# EAGLE design kgopalak_SMD (EAGLE 8.3.2)
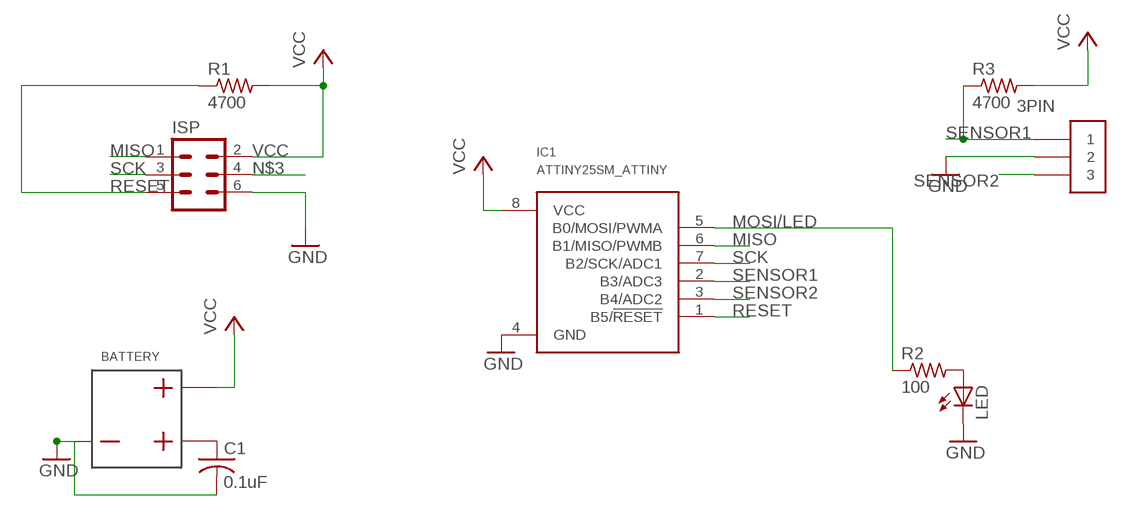
[diagram p0: schematic, sheet 1]

## Parts
3PIN  3PINCONSM_3PIN  [SM3PIN]
BATTERY  BATTERYSM_BA2032  [BA2032SM]
C1  0.1uF  CAPACITORSM_CAP  [C0402]
IC1  ATTINY25SM_ATTINY  [8S1]
ISP  6PINCON_ISPSM_6PIN  [SM6PIN]
LED  LEDSMLED  [CHIPLED_0603]
R1  4700  RESISTORSMRESISTOR  [R0402]
R2  100  RESISTORSMRESISTOR  [R0402]
R3  4700  RESISTORSMRESISTOR  [R0402]

## Nets
GND: 3PIN.2 BATTERY.1 C1.2 IC1.4(GND) ISP.6 LED.C
MISO: IC1.6(B1/MISO/PWMB) ISP.1
MOSI/LED: IC1.5(B0/MOSI/PWMA) R2.1
N$1: LED.A R2.2
N$3: ISP.4
N$14: BATTERY.3 C1.1
RESET: IC1.1(B5/!RESET) ISP.5 R1.1
SCK: IC1.7(B2/SCK/ADC1) ISP.3
SENSOR1: 3PIN.1 IC1.2(B3/ADC3) R3.1
SENSOR2: 3PIN.3 IC1.3(B4/ADC2)
VCC: BATTERY.2 IC1.8(VCC) ISP.2 R1.2 R3.2

## Library data of the parts
3PIN = TinyGadget(1):3PINCON
BATTERY = TinyGadget(1):BATTERY
C1 = TinyGadget(1):CAPACITOR
IC1 = TinyGadget(1):ATTINY25
ISP = TinyGadget(1):6PINCON_ISP
LED = TinyGadget(1):LED
R1-R3 = TinyGadget(1):RESISTOR

## Board
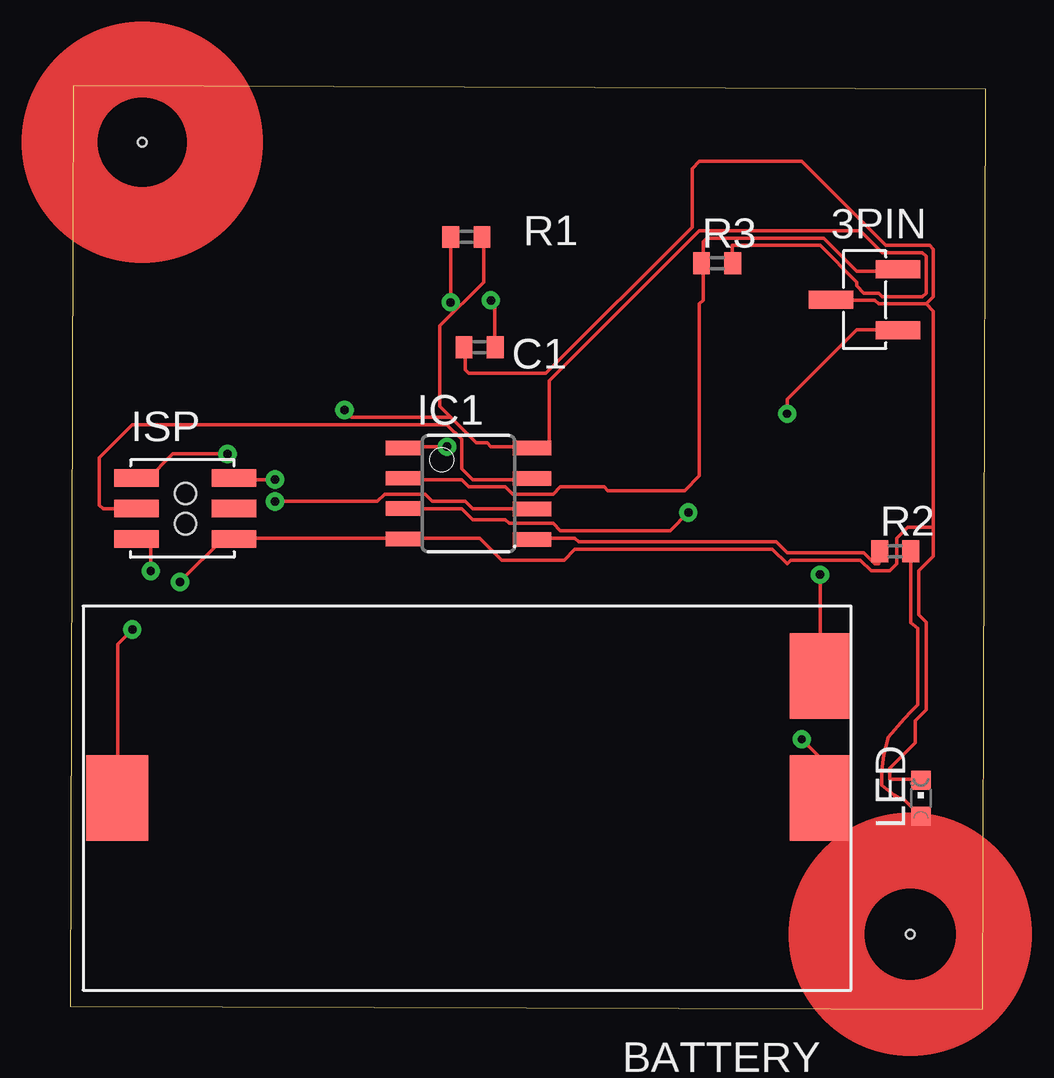
[diagram p1: board, top side]
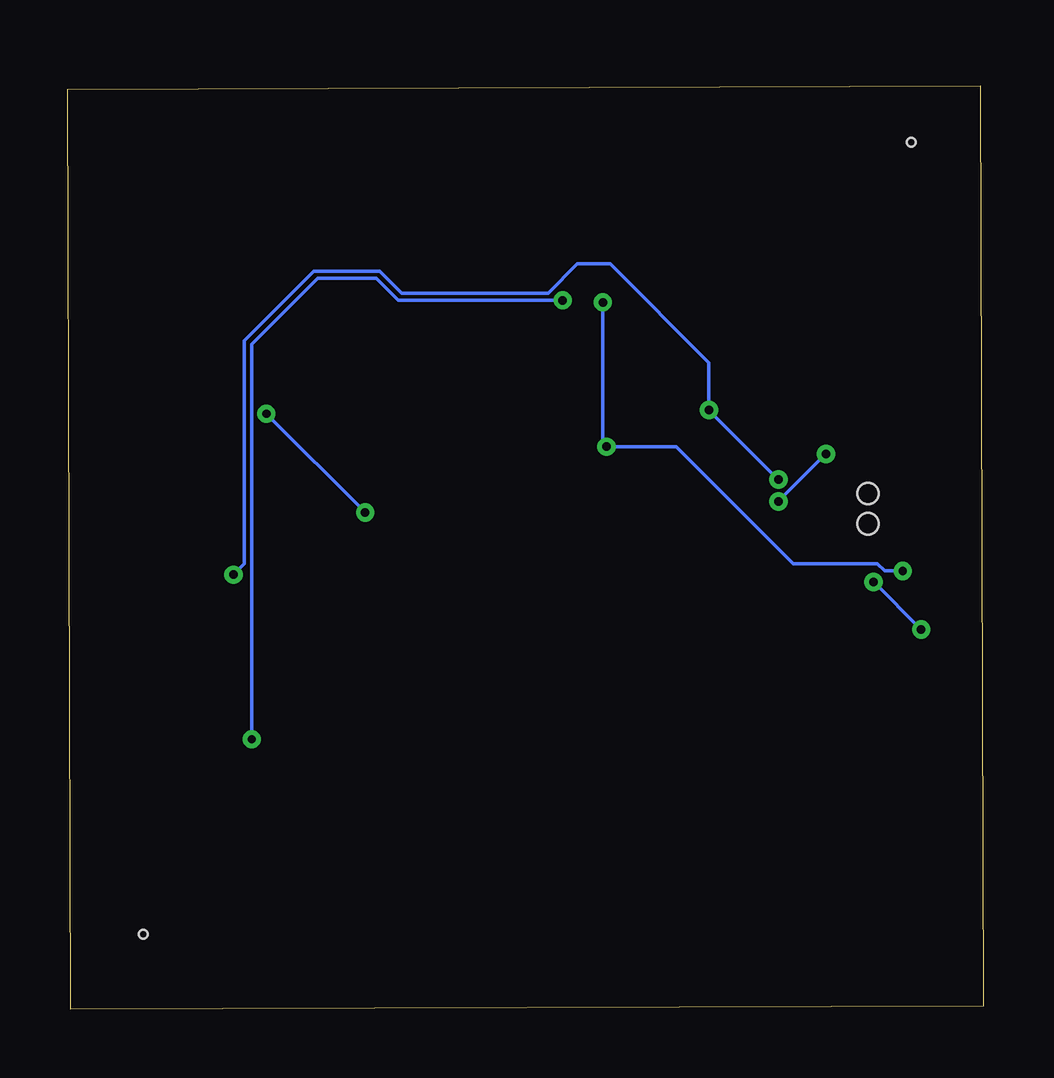
[diagram p2: board, bottom side, seen from below]

Size 38.15 x 38.47 mm. Coordinates in mm from the lower left corner, seen from the top.
Outline: 0,0.13 38.02,0 38.15,38.34 0.13,38.47 0,0.13
Copper layers (1*16): Top 0.035mm / dielectric 1.5mm / Bottom 0.035mm
Design rules "default": minimum track width 6mil, minimum drill 0.35mm, track to track 6mil, track to pad 6mil, pad to pad 6mil, via to via 6mil, smd to smd 6mil, copper to edge 40mil, drill to drill 6mil, minimum pad ring 10mil, minimum via ring 8mil, stop-mask expansion 4mil, vias tented up to drill 0mil, thermal gap 10mil
Holes 0.35 mm at 3,36.13 35,3.13

### Footprints (pad centres in the part's own frame; a part is rotated, then mirrored left to right if it is on the bottom)
SM3PIN = smd 0.737 x 1.854: 1 0,0; 2 1.27,-2.794; 3 2.54,0
BA2032SM = smd 2.591 x 3.556: 1 29.312,0; 2 0,-5.08; 3 0,0
C0402 = smd 0.7 x 0.9: 1 -0.65,0; 2 0.65,0
8S1 = smd 0.6 x 1.6: 1 -1.905,-2.654; 2 -0.645,-2.654; 3 0.625,-2.654; 4 1.895,-2.654; 5 1.905,2.654; 6 0.635,2.654; 7 -0.635,2.654; 8 -1.905,2.654
SM6PIN = smd 0.737 x 1.854: 1 0,-1.27; 2 0,2.794; 3 1.27,-1.27; 4 1.27,2.794; 5 2.54,-1.27; 6 2.54,2.794 | hole 0.889: 0.635,0.762; 1.905,0.762
CHIPLED_0603 = smd 0.8 x 0.8: A 0,-0.75; C 0,0.75
R0402 = smd 0.7 x 0.9: 1 -0.65,0; 2 0.65,0

### Placement (x,y rotation side)
3PIN  34.5,30.83 270 top
BATTERY  31.27,8.8 180 top
C1  17.06,27.58 180 top
IC1  16.59,21.48 270 top
ISP  4.04,22.13 270 top
LED  35.45,8.79 0 top
R1  16.51,32.19 0 top
R2  34.38,19.08 0 top
R3  26.96,31.08 0 top

### Tracks (layer width: path | path; a pad name or v marks a point on that pad's centre or on a via)
GND  (via drill 0.35)
  Top 0.152: v2.59,15.82 1.98,15.21 1.98,8.81 BATTERY.1 | v4.57,17.8 6.4,19.63 6.71,19.63 ISP.6 6.86,19.63 13.87,19.63 IC1.4 14.02,19.63 17.07,19.63 17.98,18.72 20.57,18.72 21.03,19.18 29.26,19.18 29.87,18.57 30.02,18.72 32.92,18.72 33.38,18.26 34.14,18.26 34.44,18.57 34.44,19.63 34.9,20.09 35.97,20.09 | 35.97,20.09 35.97,29.08 35.66,29.39 | 35.97,20.09 35.97,18.87 35.36,18.26 35.36,16.43 35.66,16.13 35.66,12.47 35.2,12.01 35.2,11.1 34.14,10.03 34.14,9.58 35.36,9.58 LED.C | 35.66,29.39 33.68,29.39 33.53,29.54 31.85,29.54 3PIN.2 | 35.66,29.39 35.97,29.69 35.97,31.67 35.81,31.83 33.98,31.83 30.48,35.33 26.21,35.33 25.91,35.03 25.91,32.59 19.81,26.49 16.61,26.49 16.46,26.64 16.46,27.56 C1.2
  Bottom 0.152: v4.57,17.8 v2.59,15.82
MISO  (via drill 0.35)
  Top 0.152: v8.53,21.16 12.8,21.16 13.11,21.46 14.78,21.46 15.09,21.16 16.46,21.16 16.76,20.85 19.2,20.85 IC1.6 | v6.55,23.14 4.27,23.14 3.2,22.07 2.9,22.07 ISP.1
  Bottom 0.152: v6.55,23.14 v8.53,21.16
MOSI/LED
  Top 0.152: R2.1 33.68,19.02 33.68,18.57 33.53,18.57 33.07,19.02 29.87,19.02 29.41,19.48 21.18,19.48 21.03,19.63 19.36,19.63 IC1.5
N$1
  Top 0.152: R2.2 35.03,16.11 35.32,15.88 35.32,13.88 35.32,12.7 35.05,12.43 34.75,12.1 34.08,11.34 33.99,11 33.89,10.58 33.81,9.95 33.81,9.54 33.81,9.33 34.33,8.93 34.55,8.79 34.7,8.79 LED.A
N$14  (via drill 0.35)
  Top 0.152: v17.53,29.54 17.68,29.39 17.68,27.71 C1.1 | v30.48,11.25 31.24,10.49 31.24,8.81 BATTERY.3
  Bottom 0.152: v17.53,29.54 24.38,29.54 25.3,30.45 27.74,30.45 30.48,27.71 v30.48,11.25
RESET  (via drill 0.35)
  Top 0.152: v15.85,29.45 15.85,32.13 R1.1 | v15.7,23.44 14.02,23.44 IC1.1 | v3.35,18.26 3.35,19.63 2.9,19.63 ISP.5
  Bottom 0.152: v15.85,29.45 15.85,23.6 v15.7,23.44 12.8,23.44 7.92,18.57 4.42,18.57 4.12,18.26 v3.35,18.26
SCK
  Top 0.152: IC1.7 19.2,22.07 16.76,22.07 16.31,22.53 16.31,23.75 15.7,24.36 2.59,24.36 1.22,22.99 1.22,21.01 1.37,20.85 2.74,20.85 ISP.3
SENSOR1
  Top 0.152: 3PIN.1 34.44,30.76 32.77,30.76 31.39,32.13 26.52,32.13 26.36,31.98 26.36,31.22 R3.1 26.36,31.06 26.36,29.54 26.21,29.39 26.21,22.22 25.6,21.61 22.4,21.61 22.25,21.77 20.42,21.77 20.12,21.46 18.44,21.46 18.14,21.77 16.61,21.77 16.31,22.07 14.02,22.07 IC1.2
SENSOR2  (via drill 0.35)
  Top 0.152: v25.76,20.7 24.99,19.94 20.42,19.94 20.12,20.24 18.29,20.24 18.14,20.4 16.76,20.4 16.31,20.85 14.02,20.85 IC1.3 | v29.87,24.82 29.87,25.42 32.77,28.32 34.44,28.32 3PIN.3
  Bottom 0.152: v29.87,24.82 v25.76,20.7
VCC  (via drill 0.35)
  Top 0.152: 15.85,24.66 16.92,23.6 17.37,23.6 17.53,23.44 19.2,23.44 IC1.8 19.36,23.44 19.96,23.44 19.96,26.19 26.21,32.44 32.92,32.44 33.83,31.52 35.51,31.52 35.66,31.37 35.66,29.84 35.51,29.69 33.83,29.69 33.68,29.84 33.07,29.84 32.77,30.15 32.77,30.3 31.24,31.83 27.58,31.83 27.58,31.22 R3.2 | 15.85,24.66 15.39,25.12 15.39,28.47 17.22,30.3 17.22,32.13 R1.2 | v8.53,22.07 6.86,22.07 ISP.2 | v11.43,24.97 11.73,24.66 15.85,24.66 | v31.24,18.11 31.24,14 BATTERY.2
  Bottom 0.152: v8.53,22.07 v11.43,24.97 11.43,26.95 15.54,31.06 16.92,31.06 18.14,29.84 24.23,29.84 25.15,30.76 27.89,30.76 30.79,27.86 30.79,18.57 v31.24,18.11
(copper drawn outside any net)
  shapes: Top circle x2